# EAGLE schematic USB Switch PCB (EAGLE 8.2.1)
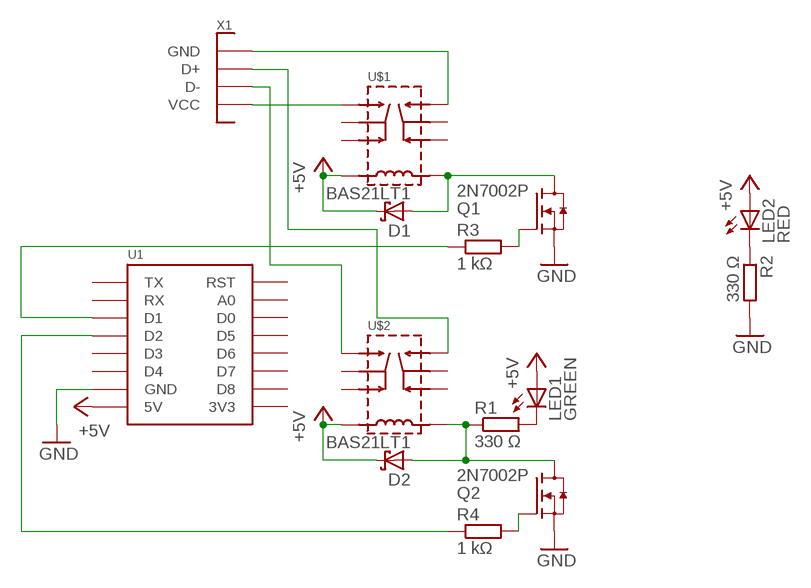
[diagram p0: schematic, sheet 1]

## Parts
D1  BAS21LT1  BAS40  [SOT23]
D2  BAS21LT1  BAS40  [SOT23]
LED1  GREEN  LEDCHIPLED_0805  [CHIPLED_0805]
LED2  RED  LEDCHIPLED_0805  [CHIPLED_0805]
Q1  2N7002P  2N7002P2N7002P  [SOT23]
Q2  2N7002P  2N7002P2N7002P  [SOT23]
R1  330 Ω  R-EU_R0603  [R0603]
R2  330 Ω  R-EU_R0603  [R0603]
R3  1 kΩ  R-EU_R0603  [R0603]
R4  1 kΩ  R-EU_R0603  [R0603]
U1  D1MINI  [D1MINI]
U$1  EC2-5NUEC2-5NU  [EC2-5NU]
U$2  EC2-5NUEC2-5NU  [EC2-5NU]
X1  UE27-USBA  [UE27-USBA]

## Nets
+5V: D1.3(C) D2.3(C) LED1.A LED2.A U1.5V U$1.1(P) U$2.1(P)
GND: Q1.2(S) Q2.2(S) R2.2 U1.GND
N$1: LED1.C R1.2
N$2: LED2.C R2.1
N$3: Q1.1(G) R3.2
N$4: Q2.1(G) R4.2
N$5: R3.1 U1.D1
N$6: D1.1(A) Q1.3(D) U$1.12(N)
N$7: R4.1 U1.D2
N$8: D2.1(A) Q2.3(D) R1.1 U$2.12(N)
N$9: U$1.5(A1) X1.VCC
N$10: U$1.8(A2) X1.GND
N$11: U$2.5(A1) X1.D-
N$12: U$2.8(A2) X1.D+
Unconnected: U1.3V3 U1.A0 U1.D0 U1.D3 U1.D4 U1.D5 U1.D6 U1.D7 U1.D8 U1.RST U1.RX U1.TX U$1.3(B1) U$1.4(C1) U$1.9(C2) U$1.10(B2) U$2.3(B1) U$2.4(C1) U$2.9(C2) U$2.10(B2)

## Library data of the parts
D1 D2 = diode:BAS40: Silicon Schottky Diodes General-purpose diode for high-speed switching
LED1 LED2 = led:LED: LED OSRAM: - CHIPLED LG R971, LG N971, LY N971, LG Q971, LY Q971, LO R971, LY R971 LH N974, LH R974 LS Q976, LO Q976, LY Q976 LO Q996 - Hyper CHIPLED LW Q18S LB Q993, LB Q99A, LB R99A - SideLED LS A670, LO A670, LY A670, LG A670, LP A670 LB A673, LV A673, LT A673, LW A673 LH A674 LY A675 LS A676, LA A676, LO A676, LY A676, LW A676 LS A679, LY A679, LG A679 - Hyper Micro SIDELED® LS Y876, LA Y876, LO Y876, LY Y876 LT Y87S - SmartLED LW L88C, LW L88S LB L89C, LB L89S, LG L890 LS L89K, LO L89K, LY L89K LS L896, LA L896, LO L896, LY L896 - TOPLED LS T670, LO T670, LY T670, LG T670, LP T670 LSG T670, LSP T670, LSY T670, LOP T670, LYG T670 LG T671, LOG T671, LSG T671 LB T673, LV T673, LT T673, LW T673 LH T674 LS T676, LA T676, LO T676, LY T676, LB T676, LH T676, LSB T676, LW T676 LB T67C, LV T67C, LT T67C, LS T67K, LO T67K, LY T67K, LW E67C LS E67B, LA E67B, LO E67B, LY E67B, LB E67C, LV E67C, LT E67C LW T67C LS T679, LY T679, LG T679 LS T770, LO T770, LY T770, LG T770, LP T770 LB T773, LV T773, LT T773, LW T773 LH T774 LS E675, LA E675, LY E675, LS T675 LS T776, LA T776, LO T776, LY T776, LB T776 LHGB T686 LT T68C, LB T68C - Hyper Mini TOPLED® LB M676 - Mini TOPLED Santana® LG M470 LS M47K, LO M47K, LY M47K Source: http://www.osram.convergy.de LUXEON: - LUMILED® LXK2-PW12-R00, LXK2-PW12-S00, LXK2-PW14-U00, LXK2-PW14-V00 LXK2-PM12-R00, LXK2-PM12-S00, LXK2-PM14-U00 LXK2-PE12-Q00, LXK2-PE12-R00, LXK2-PE12-S00, LXK2-PE14-T00, LXK2-PE14-U00 LXK2-PB12-K00, LXK2-PB12-L00, LXK2-PB12-M00, LXK2-PB14-N00, LXK2-PB14-P00, LXK2-PB14-Q00 LXK2-PR12-L00, LXK2-PR12-M00, LXK2-PR14-Q00, LXK2-PR14-R00 LXK2-PD12-Q00, LXK2-PD12-R00, LXK2-PD12-S00 LXK2-PH12-R00, LXK2-PH12-S00 LXK2-PL12-P00, LXK2-PL12-Q00, LXK2-PL12-R00 Source: www.luxeon.com KINGBRIGHT: KA-3528ASYC Source: www.kingbright.com
Q1 Q2 = USB Switch PCB:2N7002P
R1-R4 = rcl:R-EU_: RESISTOR, European symbol
U1 = USB Switch PCB:D1MINI
U$1 U$2 = USB Switch PCB:EC2-5NU
X1 = USB Switch PCB:UE27-USBA